# Altium schematic sheet Power.SchDoc
size A
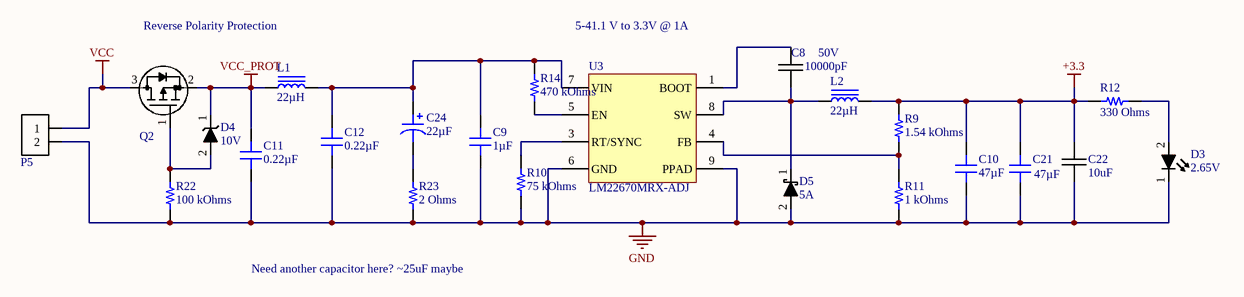
[diagram p0: Power.SchDoc]

## Parts
C8  Capacitance: 10000pF  Voltage Rating: 50V  [chip_0805]  (hidden comment: cap_single_np)
C9  1µF  [CAP 0805_2012]
C10  47µF  [CAP 0805_2012]
C11  0.22µF  [CAP 0603_1608]
C12  0.22µF  [CAP 0603_1608]
C21  47µF  [CAP 0805_2012]
C22  10uF  [chip_1206]
C24  22µF  [CAP TH ALUM ELEC D8.00mm S3.50mm H12.50mm]
D3  Forward Voltage: 2.65V  [chip_0603_LED]  (hidden comment: diode_4)
D4  Reverse Breakdown Voltage: 10V  [sod323_0]  (hidden comment: diode_1)
D5  Current Rating: 5A  [do-214ab]  (hidden comment: diode_2)
L1  22µH  [WURTH WE-LQS 6045]
L2  22µH  [WURTH WE-LQS 6045]
P5  conn-2x1_0  [BARR_0.5IN_2x1_0]  (value not drawn)
Q2  p-mosfet_1  [sot-23-3]  (value not drawn)
R9  1.54 kOhms  [RES 0805_2012]
R10  75 kOhms  [RES 0603_1608]
R11  1 kOhms  [RES 0805_2012]
R12  330 Ohms  [RES 0603_1608]
R14  470 kOhms  [RES 0805_2012]
R22  100 kOhms  [RES 0603_1608]
R23  2 Ohms  [RES 0603_1608]
U3  LM22670MRX-ADJ  [SO-8_PPAD]

## Nets
+3.3: C10.2 C21.2 C22.1 L2.2 R9.2 R12.1
GND: C9.1 C10.1 C11.1 C12.1 C21.1 C22.2 D3.1 D5.2 P5.2 R10.1 R11.1 R22.1 R23.1 U3.6(GND) U3.9(PPAD)
VCC: P5.1 Q2.3(D)
VCC_PROT: C11.2 D4.1 L1.1 Q2.2(S)
NetC8_1: C8.1 U3.1(BOOT)
NetC8_2: C8.2 D5.1 L2.1 U3.8(SW)
NetC9_2: C9.2 C12.2 C24.1 L1.2 R14.2 U3.7(VIN)
NetC24_2: C24.2 R23.2
NetD3_2: D3.2 R12.2
NetD4_2: D4.2 Q2.1(G) R22.2
NetR9_1: R9.1 R11.2 U3.4(FB)
NetR10_2: R10.2 U3.3(RT/SYNC)
NetR14_1: R14.1 U3.5(EN)

Not connected (* = marked no-connect by the designer): U3 2(NC)

## Notes on the sheet
- Reverse Polarity Protection
- 5-41.1 V to 3.3V @ 1A
- Need another capacitor here? ~25uF maybe

## Library data of the parts
C8 = CAP-00044: CAP, 10000pF, 10%, 50V, X7R, 0805; Manufacturer: Murata; Manufacturer PN: GRM216R71H103KA01J; Tolerance: 10%; Part Number: CAP-00044; Type: X7R
C9 = GCM21BR71H105KA03L: CAP CER 1UF 50V X7R 0805; Manufacturer: Murata Electronics; Tolerance: ±10%; Part Number: GCM21BR71H105KA03L; Value: 1µF; Applications: Automotive; Capacitance: 1µF; ComponentLink1Description: Datasheet; ComponentLink1URL: https://www.murata.com/~/media/webrenewal/support/library/catalog/products/capacitor/mlcc/c03e.ashx?la=en-us; ComponentLink2Description: DigiKey Link; ComponentLink2URL: http://digikey.com/product-detail/en/murata-electronics/GCM21BR71H105KA03L/490-10675-1-ND/5251430; Device Package: 0805 (2012 Metric); LastUpdated: 9/2/2020 1:04:41 AM; Lifecycle Status: Active; Minimum Order: 1; Mounting Type: Surface Mount, MLCC; Operating Temperature: -55°C ~ 125°C; Package / Case: 0805 (2012 Metric); Packaging: TapeAndReel; PartId: 2659; Part Status: Active; Price: 0.08; Ratings: AEC-Q200; Series: GCM; Size / Dimension: 0.079" L x 0.049" W (2.00mm x 1.25mm); Supplier 1: DigiKey; Supplier Part Number 1: 490-10675-1-ND; Temperature Coefficient: X7R; Thickness (Max): 0.055" (1.40mm); Voltage - Rated: 50V
C10 C21 = GRM21BR61A476ME15L: CAP CER 47UF 10V X5R 0805; Manufacturer: Murata Electronics; Tolerance: ±20%; Part Number: GRM21BR61A476ME15L; Value: 47µF; Applications: General Purpose; Capacitance: 47µF; ComponentLink1Description: Datasheet; ComponentLink1URL: https://search.murata.co.jp/Ceramy/image/img/A01X/G101/ENG/GRM21BR61A476ME15-01.pdf; ComponentLink2Description: DigiKey Link; ComponentLink2URL: http://digikey.com/product-detail/en/murata-electronics/GRM21BR61A476ME15L/490-9961-1-ND/5026442; Device Package: 0805 (2012 Metric); LastUpdated: 9/2/2020 1:04:38 AM; Lifecycle Status: Active; Minimum Order: 1; Mounting Type: Surface Mount, MLCC; Operating Temperature: -55°C ~ 85°C; Package / Case: 0805 (2012 Metric); Packaging: TapeAndReel; PartId: 4627; Part Status: Active; Price: 0.19; Series: GRM; Size / Dimension: 0.079" L x 0.049" W (2.00mm x 1.25mm); Supplier 1: DigiKey; Supplier Part Number 1: 490-9961-1-ND; Temperature Coefficient: X5R; Thickness (Max): 0.057" (1.45mm); Voltage - Rated: 10V
C11 C12 = 0603BB224K500YT: CAP CER 0.22UF 50V X7R 0603; Manufacturer: Knowles Novacap; Tolerance: ±10%; Part Number: 0603BB224K500YT; Value: 0.22µF; Applications: General Purpose; Capacitance: 0.22µF; ComponentLink1Description: Datasheet; ComponentLink1URL: https://www.knowlescapacitors.com/getattachment/6c8d48ef-fc2b-4752-ae2c-ce6c208de0c4/High-Capacitance-Chip.aspx; ComponentLink2Description: DigiKey Link; ComponentLink2URL: http://digikey.com/product-detail/en/knowles-novacap/0603BB224K500YT/1763-1192-1-ND/7304302; Device Package: 0603 (1608 Metric); LastUpdated: 9/2/2020 1:03:36 AM; Lifecycle Status: Active; Minimum Order: 1; Mounting Type: Surface Mount, MLCC; Operating Temperature: -55°C ~ 125°C; Package / Case: 0603 (1608 Metric); Packaging: TapeAndReel; PartId: 2162; Part Status: Active; Price: 0.52; Series: -; Size / Dimension: 0.060" L x 0.030" W (1.52mm x 0.76mm); Supplier 1: DigiKey; Supplier Part Number 1: 1763-1192-1-ND; Temperature Coefficient: X7R; Thickness (Max): 0.035" (0.89mm); Voltage - Rated: 50V
C22 = CAP-00539: CAP, 10uF, ±10%, 25V, X7R, 1206; Manufacturer: Samsung; Manufacturer PN: CL31B106KAHNNNE; Part Number: CAP-00539; Capacitance: 10uF; Tolerance: ±10%; Voltage Rating: 25V; Type: X7R
C24 = UKL1J220KPD: CAP ALUM 22UF 10% 63V RADIAL; Manufacturer: Nichicon; Lifetime @ Temp.: 2000 Hrs @ 85°C; Polarization: Polar; Ripple Current @ High Frequency: 230mA @ 10kHz; Ripple Current @ Low Frequency: 115mA @ 120Hz; Part Number: UKL1J220KPD; Applications: General Purpose; Capacitance: 22µF; ComponentLink1Description: Datasheet; ComponentLink1URL: http://nichicon-us.com/english/products/pdfs/e-ukl.pdf; ComponentLink2Description: DigiKey Link; ComponentLink2URL: http://digikey.com/product-detail/en/nichicon/UKL1J220KPD/493-15394-ND/2598504; Device Package: Radial, Can; Height - Seated (Max): 0.492" (12.50mm); LastUpdated: 9/7/2020 5:24:52 AM; Lead Spacing: 0.138" (3.50mm); Lifecycle Status: Active; Minimum Order: 1; Mounting Type: Through Hole; Operating Temperature: -40°C ~ 85°C; Package / Case: Radial, Can; Packaging: Bulk; PartId: 7201; Part Status: Active; Price: 0.55; Series: UKL; Size / Dimension: 0.315" Dia (8.00mm); Supplier 1: DigiKey; Supplier Part Number 1: 493-15394-ND; Tolerance: ±10%; Value: 22µF; Voltage - Rated: 63V
D3 = DIO-00050: LED, Green, 0603, Low current, HELI2 Series; Manufacturer: Kingbright; Manufacturer PN: APT1608LZGCK; Reverse Breakdown Voltage: 5V; Current Rating: 30mA; Power Rating: 120mW; Type: LED; Part Number: DIO-00050; Cost: 0.58
D4 = DIO-00019: Dio Zen, 10V, 2%, 200mW, SOD-323; Manufacturer: ON Semi; Manufacturer PN: MM3Z10VST1G; Forward Voltage: 900mV; Type: Zener; Part Number: DIO-00019; Tolerance: 2%; Power Rating: 200mW
D5 = DIO-00048: Dio, Schottky, 5A, 700mV, 60V, SMC; Manufacturer: Diodes Incorporated; Manufacturer PN: B560C-13-F; Forward Voltage: 700mV; Type: Schottky; Reverse Breakdown Voltage: 60V; Part Number: DIO-00048; Cost: 0.5
L1 L2 = 74404064220: FIXED IND 22UH 1.8A 89 MOHM SMD; Manufacturer: Würth Elektronik; Current - Saturation: 2.2A; DC Resistance (DCR): 89mOhm; Frequency - Self Resonant: 15MHz; Inductance Frequency - Test: 100kHz; Material - Core: Ferrite; Shielding: Shielded; Tolerance: ±20%; Type: Wirewound; Part Number: 74404064220; ComponentLink1Description: Datasheet; ComponentLink1URL: https://katalog.we-online.de/pbs/datasheet/74404064220.pdf; ComponentLink2Description: DigiKey Link; ComponentLink2URL: http://digikey.com/product-detail/en/w-rth-elektronik/74404064220/732-5554-1-ND/4865447; Current Rating (Amps): 1.8A; Device Package: Nonstandard; Height - Seated (Max): 0.177" (4.50mm); Inductance: 22µH; LastUpdated: 9/2/2020 1:30:28 AM; Lifecycle Status: Active; Minimum Order: 1; Mounting Type: Surface Mount; Operating Temperature: -40°C ~ 125°C; Package / Case: Nonstandard; Packaging: TapeAndReel; PartId: 3707; Part Status: Active; Price: 0.69; Series: WE-LQS; Size / Dimension: 0.236" L x 0.236" W (6.00mm x 6.00mm); Supplier 1: DigiKey; Supplier Part Number 1: 732-5554-1-ND; Supplier Device Package: 6045; Value: 22µH
P5 = CONN-00001: Barrier Blk, 2 Pos, 50 A; Manufacturer: Molex; Manufacturer PN: 389690002; Positions per level: 2; Levels: 1; Current: 50; Part Number: CONN-00001; Type: Barrier Block; Cost: 1.68; Weight: 7.5
Q2 = XSTR-00009: XSTR NMOS, 1.5A, 40V, Vgs 2.5V, SOT-23-3; Manufacturer: NXP; Manufacturer PN: PMV250EPEAR; Max Power: 480mW; Type: PFET; Part Number: XSTR-00009; Max Voltage: 40V; Max Current: 1.5A; Vgs/Vce: 2.5V
R9 = CRCW08051K54FKEA: RES SMD 1.54K OHM 1% 1/8W 0805; Manufacturer: Vishay Dale; Power (Watts): 0.125W, 1/8W; Temperature Coefficient: ±100ppm/°C; Part Number: CRCW08051K54FKEA; Value: 1.54 kOhms; ComponentLink1Description: Datasheet; ComponentLink1URL: http://www.vishay.com/docs/20035/dcrcwe3.pdf; ComponentLink2Description: DigiKey Link; ComponentLink2URL: http://digikey.com/product-detail/en/vishay-dale/CRCW08051K54FKEA/541-1.54KCCT-ND/1180802; Composition: Thick Film; Device Package: 0805 (2012 Metric); Features: Automotive AEC-Q200; Height - Seated (Max): 0.020" (0.50mm); LastUpdated: 9/2/2020 1:14:58 AM; Lifecycle Status: Active; Minimum Order: 1; Number of Terminations: 2; Operating Temperature: -55°C ~ 155°C; Package / Case: 0805 (2012 Metric); Packaging: TapeAndReel; PartId: 39717; Part Status: Active; Price: 0.01; Ratings: AEC-Q200; Resistance: 1.54 kOhms; Series: CRCW; Size / Dimension: 0.079" L x 0.049" W (2.00mm x 1.25mm); Supplier 1: DigiKey; Supplier Part Number 1: 541-1.54KCCT-ND; Supplier Device Package: 0805; Tolerance: ±1%
R10 = RCS060375K0FKEA: RES SMD 75K OHM 1% 1/4W 0603; Manufacturer: Vishay Dale; Power (Watts): 0.25W, 1/4W; Temperature Coefficient: ±100ppm/°C; Part Number: RCS060375K0FKEA; Value: 75 kOhms; ComponentLink1Description: Datasheet; ComponentLink1URL: http://www.vishay.com/docs/20065/rcse3.pdf; ComponentLink2Description: DigiKey Link; ComponentLink2URL: http://digikey.com/product-detail/en/vishay-dale/RCS060375K0FKEA/541-10492-1-ND/10059858; Composition: Thick Film; Device Package: 0603 (1608 Metric); Features: Automotive AEC-Q200, Pulse Withstanding; Height - Seated (Max): 0.020" (0.50mm); LastUpdated: 9/2/2020 1:09:31 AM; Lifecycle Status: Active; Minimum Order: 1; Number of Terminations: 2; Operating Temperature: -55°C ~ 155°C; Package / Case: 0603 (1608 Metric); Packaging: TapeAndReel; PartId: 25636; Part Status: Active; Price: 0.02; Ratings: AEC-Q200; Resistance: 75 kOhms; Series: RCS e3; Size / Dimension: 0.061" L x 0.033" W (1.55mm x 0.85mm); Supplier 1: DigiKey; Supplier Part Number 1: 541-10492-1-ND; Supplier Device Package: 0603; Tolerance: ±1%
R11 = CRCW08051K00FKEA: RES SMD 1K OHM 1% 1/8W 0805; Manufacturer: Vishay Dale; Power (Watts): 0.125W, 1/8W; Temperature Coefficient: ±100ppm/°C; Part Number: CRCW08051K00FKEA; Value: 1 kOhms; ComponentLink1Description: Datasheet; ComponentLink1URL: http://www.vishay.com/docs/20035/dcrcwe3.pdf; ComponentLink2Description: DigiKey Link; ComponentLink2URL: http://digikey.com/product-detail/en/vishay-dale/CRCW08051K00FKEA/541-1.00KCCT-ND/1180783; Composition: Thick Film; Device Package: 0805 (2012 Metric); Features: Automotive AEC-Q200; Height - Seated (Max): 0.020" (0.50mm); LastUpdated: 9/2/2020 1:15:23 AM; Lifecycle Status: Active; Minimum Order: 1; Number of Terminations: 2; Operating Temperature: -55°C ~ 155°C; Package / Case: 0805 (2012 Metric); Packaging: TapeAndReel; PartId: 28103; Part Status: Active; Price: 0.01; Ratings: AEC-Q200; Resistance: 1 kOhms; Series: CRCW; Size / Dimension: 0.079" L x 0.049" W (2.00mm x 1.25mm); Supplier 1: DigiKey; Supplier Part Number 1: 541-1.00KCCT-ND; Supplier Device Package: 0805; Tolerance: ±1%
R12 = RK73B1JTTD331J: RES 330 OHM 5% 1/8W 0603; Manufacturer: KOA Speer Electronics, Inc.; Power (Watts): 0.125W, 1/8W; Temperature Coefficient: ±200ppm/°C; Part Number: RK73B1JTTD331J; Value: 330 Ohms; ComponentLink1Description: Datasheet; ComponentLink1URL: http://www.koaspeer.com/catimages/Products/RK73B/RK73B.pdf; ComponentLink2Description: DigiKey Link; ComponentLink2URL: http://digikey.com/product-detail/en/koa-speer-electronics-inc/RK73B1JTTD331J/2019-RK73B1JTTD331JCT-ND/9846751; Composition: Thick Film; Device Package: 0603 (1608 Metric); Features: Automotive AEC-Q200, Moisture Resistant; Height - Seated (Max): 0.022" (0.55mm); LastUpdated: 9/2/2020 1:10:22 AM; Lifecycle Status: Active; Minimum Order: 1; Number of Terminations: 2; Operating Temperature: -55°C ~ 155°C; Package / Case: 0603 (1608 Metric); Packaging: CutTape; PartId: 5985; Part Status: Active; Price: 0.10; Ratings: AEC-Q200; Resistance: 330 Ohms; Series: RK73B; Size / Dimension: 0.063" L x 0.031" W (1.60mm x 0.80mm); Supplier 1: DigiKey; Supplier Part Number 1: 2019-RK73B1JTTD331JCT-ND; Supplier Device Package: 0603; Tolerance: ±5%
R14 = RMCF0805FT470K: RES 470K OHM 1% 1/8W 0805; Manufacturer: Stackpole Electronics Inc; Power (Watts): 0.125W, 1/8W; Temperature Coefficient: ±100ppm/°C; Part Number: RMCF0805FT470K; Value: 470 kOhms; ComponentLink1Description: Datasheet; ComponentLink1URL: https://www.seielect.com/catalog/sei-rmcf_rmcp.pdf; ComponentLink2Description: DigiKey Link; ComponentLink2URL: http://digikey.com/product-detail/en/stackpole-electronics-inc/RMCF0805FT470K/RMCF0805FT470KCT-ND/5049799; Composition: Thick Film; Device Package: 0805 (2012 Metric); Features: Automotive AEC-Q200; Height - Seated (Max): 0.026" (0.65mm); LastUpdated: 9/2/2020 1:15:14 AM; Lifecycle Status: Active; Minimum Order: 1; Number of Terminations: 2; Operating Temperature: -55°C ~ 155°C; Package / Case: 0805 (2012 Metric); Packaging: CutTape; PartId: 32589; Part Status: Active; Price: 0.10; Ratings: AEC-Q200; Resistance: 470 kOhms; Series: RMCF; Size / Dimension: 0.079" L x 0.049" W (2.00mm x 1.25mm); Supplier 1: DigiKey; Supplier Part Number 1: RMCF0805FT470KCT-ND; Supplier Device Package: 0805; Tolerance: ±1%
R22 = CRCW0603100KFKEAHP: RES SMD 100K OHM 1% 1/4W 0603; Manufacturer: Vishay Dale; Power (Watts): 0.25W, 1/4W; Temperature Coefficient: ±100ppm/°C; Part Number: CRCW0603100KFKEAHP; Value: 100 kOhms; ComponentLink1Description: Datasheet; ComponentLink1URL: http://www.vishay.com/docs/20043/crcwhpe3.pdf; ComponentLink2Description: DigiKey Link; ComponentLink2URL: http://digikey.com/product-detail/en/vishay-dale/CRCW0603100KFKEAHP/541-100KSCT-ND/2222790; Composition: Thick Film; Device Package: 0603 (1608 Metric); Features: Automotive AEC-Q200, Pulse Withstanding; Height - Seated (Max): 0.022" (0.55mm); LastUpdated: 9/2/2020 1:10:04 AM; Lifecycle Status: Active; Minimum Order: 1; Number of Terminations: 2; Operating Temperature: -55°C ~ 155°C; Package / Case: 0603 (1608 Metric); Packaging: TapeAndReel; PartId: 14743; Part Status: Active; Price: 0.02; Ratings: AEC-Q200; Resistance: 100 kOhms; Series: CRCW-HP; Size / Dimension: 0.063" L x 0.033" W (1.60mm x 0.85mm); Supplier 1: DigiKey; Supplier Part Number 1: 541-100KSCT-ND; Supplier Device Package: 0603; Tolerance: ±1%
R23 = ERJ-PA3J2R0V: RES SMD 2 OHM 5% 1/4W 0603; Manufacturer: Panasonic Electronic Components; Power (Watts): 0.25W, 1/4W; Temperature Coefficient: ±200ppm/°C; Part Number: ERJ-PA3J2R0V; Value: 2 Ohms; ComponentLink1Description: Datasheet; ComponentLink1URL: https://industrial.panasonic.com/cdbs/www-data/pdf/RDO0000/AOA0000C331.pdf; ComponentLink2Description: DigiKey Link; ComponentLink2URL: http://digikey.com/product-detail/en/panasonic-electronic-components/ERJ-PA3J2R0V/P2.00BZCT-ND/5036297; Composition: Thick Film; Device Package: 0603 (1608 Metric); Features: Automotive AEC-Q200, Pulse Withstanding; Height - Seated (Max): 0.022" (0.55mm); LastUpdated: 9/2/2020 1:10:16 AM; Lifecycle Status: Active; Minimum Order: 1; Number of Terminations: 2; Operating Temperature: -55°C ~ 155°C; Package / Case: 0603 (1608 Metric); Packaging: TapeAndReel; PartId: 9009; Part Status: Active; Price: 0.01; Ratings: AEC-Q200; Resistance: 2 Ohms; Series: ERJ; Size / Dimension: 0.063" L x 0.031" W (1.60mm x 0.80mm); Supplier 1: DigiKey; Supplier Part Number 1: P2.00BZCT-ND; Supplier Device Package: 0603; Tolerance: ±5%
U3 = PWREG-00055: REG, Buck, 3A, 4.5~42V Input, Simple Switcher, SOIC-8-EP; Manufacturer: TI; Voltage Range In: 4.7 ~ 42V; Voltage Range Out: 1.285 ~ 37V; Reg Type: SW Buck; Fixed/Adj: Adj; Part Number: PWREG-00055; Max Current: 3A; Manufacturer PN: LM22670MRX-ADJ; Cost: 4.31